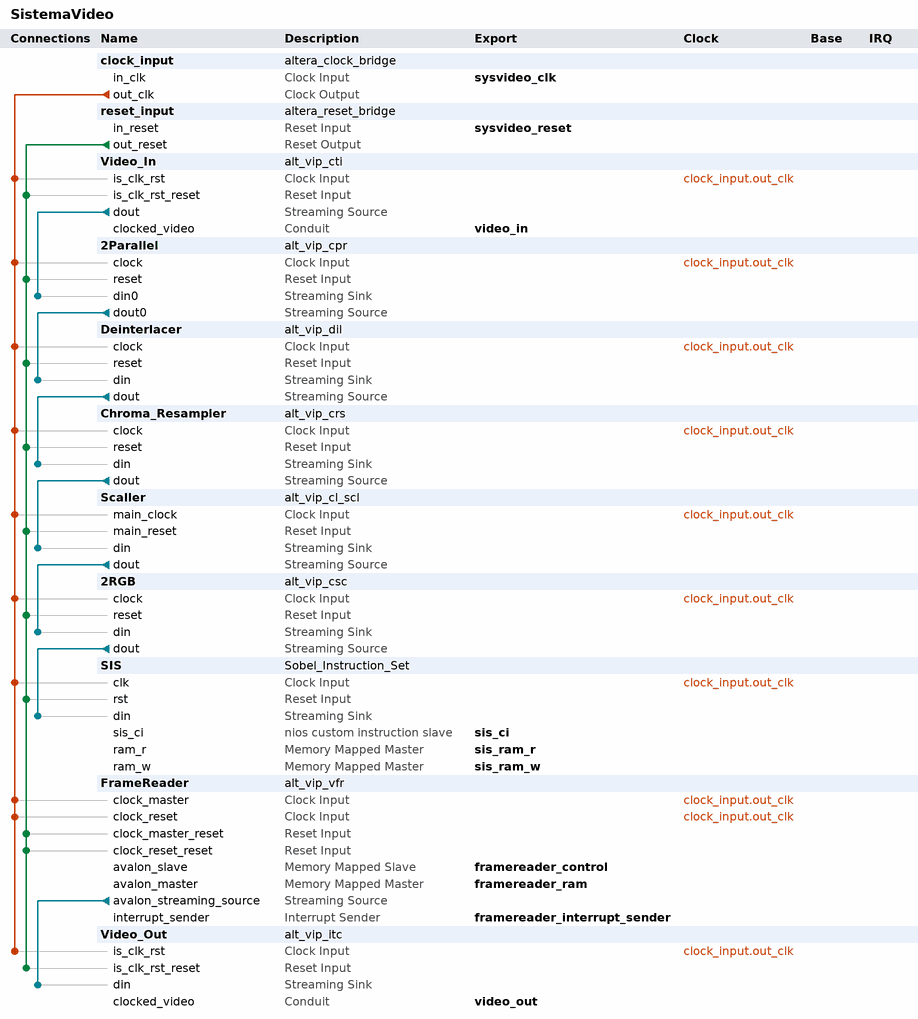
[diagram p0: system contents]
# Platform Designer (Qsys) system SistemaVideo, Cyclone III EP3C25F324C6
# Parameters at their usual value, and those the tool derives, are not listed.
package require -exact qsys 12.1
create_system SistemaVideo
set_project_property DEVICE_FAMILY {Cyclone III}
set_project_property DEVICE EP3C25F324C6

add_instance clock_input altera_clock_bridge 12.1
set_instance_parameter_value clock_input DERIVED_CLOCK_RATE 0
set_instance_parameter_value clock_input EXPLICIT_CLOCK_RATE 0

add_instance reset_input altera_reset_bridge 12.1
set_instance_parameter_value reset_input ACTIVE_LOW_RESET 0
set_instance_parameter_value reset_input SYNCHRONOUS_EDGES none

add_instance Video_In alt_vip_cti 12.1
set_instance_parameter_value Video_In FAMILY {Cyclone III}
set_instance_parameter_value Video_In BPS 8
set_instance_parameter_value Video_In NUMBER_OF_COLOUR_PLANES 2
set_instance_parameter_value Video_In COLOUR_PLANES_ARE_IN_PARALLEL 0
set_instance_parameter_value Video_In SYNC_TO 0
set_instance_parameter_value Video_In USE_EMBEDDED_SYNCS 1
set_instance_parameter_value Video_In ADD_DATA_ENABLE_SIGNAL 0
set_instance_parameter_value Video_In ACCEPT_COLOURS_IN_SEQ 0
set_instance_parameter_value Video_In USE_STD 0
set_instance_parameter_value Video_In STD_WIDTH 1
set_instance_parameter_value Video_In GENERATE_ANC 0
set_instance_parameter_value Video_In INTERLACED 1
set_instance_parameter_value Video_In H_ACTIVE_PIXELS_F0 720
set_instance_parameter_value Video_In V_ACTIVE_LINES_F0 288
set_instance_parameter_value Video_In V_ACTIVE_LINES_F1 288
set_instance_parameter_value Video_In FIFO_DEPTH 720
set_instance_parameter_value Video_In CLOCKS_ARE_SAME 0
set_instance_parameter_value Video_In USE_CONTROL 0
set_instance_parameter_value Video_In GENERATE_SYNC 0

add_instance 2Parallel alt_vip_cpr 12.1
set_instance_parameter_value 2Parallel DIN1_ENABLED 0
set_instance_parameter_value 2Parallel DOUT1_SYMBOLS_PER_BEAT 0
set_instance_parameter_value 2Parallel DOUT0_SYMBOLS_PER_BEAT 2
set_instance_parameter_value 2Parallel DOUT1_ENABLED 0
set_instance_parameter_value 2Parallel PARAMETERISATION {<colourPatternRearrangerParams><CPR_NAME>Color Plane Sequencer</CPR_NAME><CPR_BPS>8</CPR_BPS><CPR_PORTS><INPUT_PORT><NAME>din0</NAME><STREAMING_DESCRIPTOR>[C,Y]</STREAMING_DESCRIPTOR><ENABLED>true</ENABLED></INPUT_PORT><INPUT_PORT><NAME>din1</NAME><STREAMING_DESCRIPTOR>[Channel]</STREAMING_DESCRIPTOR><ENABLED>false</ENABLED></INPUT_PORT><OUTPUT_PORT><NAME>dout0</NAME><STREAMING_DESCRIPTOR>[C:Y]</STREAMING_DESCRIPTOR><ENABLED>true</ENABLED><NON_IMAGE_PACKET_SOURCE>din0</NON_IMAGE_PACKET_SOURCE><HALVE_WIDTH>false</HALVE_WIDTH></OUTPUT_PORT><OUTPUT_PORT><NAME>dout1</NAME><STREAMING_DESCRIPTOR>[Channel]</STREAMING_DESCRIPTOR><ENABLED>false</ENABLED><NON_IMAGE_PACKET_SOURCE>din0</NON_IMAGE_PACKET_SOURCE><HALVE_WIDTH>false</HALVE_WIDTH></OUTPUT_PORT></CPR_PORTS><CPR_INPUT_2_PIXELS>false</CPR_INPUT_2_PIXELS></colourPatternRearrangerParams>}
set_instance_parameter_value 2Parallel DIN0_SYMBOLS_PER_BEAT 1
set_instance_parameter_value 2Parallel DIN1_SYMBOLS_PER_BEAT 0

add_instance Deinterlacer alt_vip_dil 12.1
set_instance_parameter_value Deinterlacer READ_MASTERS_REQUIRED 0
set_instance_parameter_value Deinterlacer WRITE_MASTERS_REQUIRED 0
set_instance_parameter_value Deinterlacer PARAMETERISATION {<deinterlacerParams><DIL_NAME>my_deinterlacing_core</DIL_NAME><DIL_MAX_WIDTH>720</DIL_MAX_WIDTH><DIL_MAX_HEIGHT>576</DIL_MAX_HEIGHT><DIL_CHANNELS_IN_SEQ>1</DIL_CHANNELS_IN_SEQ><DIL_CHANNELS_IN_PAR>2</DIL_CHANNELS_IN_PAR><DIL_BPS>8</DIL_BPS><DIL_METHOD>DEINTERLACING_BOB_SCANLINE_INTERPOLATION</DIL_METHOD><DIL_FRAMEBUFFERS_ADDR>01500000</DIL_FRAMEBUFFERS_ADDR><DIL_PRODUCE_FIELDS>DEINTERLACING_BOTH</DIL_PRODUCE_FIELDS><DIL_BUFFER_AS_THOUGH>DEINTERLACING_NO_BUFFERING</DIL_BUFFER_AS_THOUGH><DIL_DEFAULT_INITIAL_FIELD>FIELD_F0_FIRST</DIL_DEFAULT_INITIAL_FIELD><DIL_MASTER_PORT_WIDTH>64</DIL_MASTER_PORT_WIDTH><DIL_MEM_MASTERS_USE_SEPARATE_CLOCK>0</DIL_MEM_MASTERS_USE_SEPARATE_CLOCK><DIL_EDGE_DEPENDENT_INTERPOLATION>1</DIL_EDGE_DEPENDENT_INTERPOLATION><DIL_MOTION_BLEED>0</DIL_MOTION_BLEED><DIL_RDATA_FIFO_DEPTH>256</DIL_RDATA_FIFO_DEPTH><DIL_RDATA_BURST_TARGET>64</DIL_RDATA_BURST_TARGET><DIL_WDATA_FIFO_DEPTH>256</DIL_WDATA_FIFO_DEPTH><DIL_WDATA_BURST_TARGET>64</DIL_WDATA_BURST_TARGET><DIL_MAX_NUMBER_PACKETS>1</DIL_MAX_NUMBER_PACKETS><DIL_MAX_SYMBOLS_IN_PACKET>10</DIL_MAX_SYMBOLS_IN_PACKET><DIL_MA_RUNTIME_CTRL>0</DIL_MA_RUNTIME_CTRL><DIL_PROPAGATE_PROGRESSIVE>false</DIL_PROPAGATE_PROGRESSIVE><DIL_CONTROLLED_DROP_REPEAT>0</DIL_CONTROLLED_DROP_REPEAT><DIL_MA_422>0</DIL_MA_422><DIL_BURST_ALIGNMENT>0</DIL_BURST_ALIGNMENT></deinterlacerParams>}
set_instance_parameter_value Deinterlacer MOTION_MASTERS_REQUIRED 0

add_instance Chroma_Resampler alt_vip_crs 12.1
set_instance_parameter_value Chroma_Resampler OUT_CHANNELS_IN_PAR 3
set_instance_parameter_value Chroma_Resampler IN_CHANNELS_IN_PAR 2
set_instance_parameter_value Chroma_Resampler PARAMETERISATION {<chromaResamplerParams><CRS_NAME>chroma_resampler</CRS_NAME><CRS_BPS>8</CRS_BPS><CRS_WIDTH>720</CRS_WIDTH><CRS_HEIGHT>576</CRS_HEIGHT><CRS_PARALLEL_MODE>true</CRS_PARALLEL_MODE><CRS_RESAMPLING><FORMAT><IN>422</IN><OUT>444</OUT></FORMAT><COSITING><V>true</V><H>true</H></COSITING></CRS_RESAMPLING><CRS_ALGORITHM><V><NAME>INTERPOLATION_1D_NEAREST_NEIGHBOUR</NAME><LUMA_ADAPTIVE>false</LUMA_ADAPTIVE></V><H><NAME>INTERPOLATION_1D_FULL_FILTERING</NAME><LUMA_ADAPTIVE>true</LUMA_ADAPTIVE></H></CRS_ALGORITHM></chromaResamplerParams>}

add_instance Scaller alt_vip_cl_scl 12.1
set_instance_parameter_value Scaller FAMILY {Cyclone III}
set_instance_parameter_value Scaller SYMBOLS_IN_SEQ 1
set_instance_parameter_value Scaller SYMBOLS_IN_PAR 3
set_instance_parameter_value Scaller BITS_PER_SYMBOL 8
set_instance_parameter_value Scaller EXTRA_PIPELINING 1
set_instance_parameter_value Scaller IS_422 0
set_instance_parameter_value Scaller NO_BLANKING 0
set_instance_parameter_value Scaller MAX_IN_WIDTH 720
set_instance_parameter_value Scaller MAX_IN_HEIGHT 576
set_instance_parameter_value Scaller MAX_OUT_WIDTH 800
set_instance_parameter_value Scaller MAX_OUT_HEIGHT 480
set_instance_parameter_value Scaller RUNTIME_CONTROL 0
set_instance_parameter_value Scaller ALWAYS_DOWNSCALE 0
set_instance_parameter_value Scaller ALGORITHM_NAME NEAREST_NEIGHBOUR
set_instance_parameter_value Scaller DEFAULT_EDGE_THRESH 7
set_instance_parameter_value Scaller DEFAULT_UPPER_BLUR 15
set_instance_parameter_value Scaller DEFAULT_LOWER_BLUR 0
set_instance_parameter_value Scaller ENABLE_FIR 0
set_instance_parameter_value Scaller ARE_IDENTICAL 0
set_instance_parameter_value Scaller V_TAPS 8
set_instance_parameter_value Scaller V_PHASES 16
set_instance_parameter_value Scaller H_TAPS 8
set_instance_parameter_value Scaller H_PHASES 16
set_instance_parameter_value Scaller V_SIGNED 1
set_instance_parameter_value Scaller V_INTEGER_BITS 1
set_instance_parameter_value Scaller V_FRACTION_BITS 7
set_instance_parameter_value Scaller H_SIGNED 1
set_instance_parameter_value Scaller H_INTEGER_BITS 1
set_instance_parameter_value Scaller H_FRACTION_BITS 7
set_instance_parameter_value Scaller PRESERVE_BITS 0
set_instance_parameter_value Scaller LOAD_AT_RUNTIME 0
set_instance_parameter_value Scaller V_BANKS 1
set_instance_parameter_value Scaller V_SYMMETRIC 0
set_instance_parameter_value Scaller V_FUNCTION LANCZOS_2
set_instance_parameter_value Scaller V_COEFF_FILE {<enter file name (including full path)>}
set_instance_parameter_value Scaller H_BANKS 1
set_instance_parameter_value Scaller H_SYMMETRIC 0
set_instance_parameter_value Scaller H_FUNCTION LANCZOS_2
set_instance_parameter_value Scaller H_COEFF_FILE {<enter file name (including full path)>}
set_instance_parameter_value Scaller IS_420 0

add_instance 2RGB alt_vip_csc 12.1
set_instance_parameter_value 2RGB PARAMETERISATION {<cscParams> <CSC_NAME>a_csc</CSC_NAME> <CSC_CHANNELS_IN_SEQ>1</CSC_CHANNELS_IN_SEQ>  <CSC_CHANNELS_IN_PAR>3</CSC_CHANNELS_IN_PAR>  <CSC_INPUT_OUTPUT_DATATYPES>   <IODT_INPUT_BPS>8</IODT_INPUT_BPS>   <IODT_OUTPUT_BPS>8</IODT_OUTPUT_BPS>   <IODT_INPUT_DATA_TYPE>DATA_TYPE_UNSIGNED</IODT_INPUT_DATA_TYPE>   <IODT_OUTPUT_DATA_TYPE>DATA_TYPE_UNSIGNED</IODT_OUTPUT_DATA_TYPE>   <IODT_USE_INPUT_GUARD_BANDS>true</IODT_USE_INPUT_GUARD_BANDS>   <IODT_INPUT_GUARD_MIN>16</IODT_INPUT_GUARD_MIN>   <IODT_INPUT_GUARD_MAX>240</IODT_INPUT_GUARD_MAX>   <IODT_USE_OUTPUT_GUARD_BANDS>false</IODT_USE_OUTPUT_GUARD_BANDS>   <IODT_OUTPUT_GUARD_MIN>0</IODT_OUTPUT_GUARD_MIN>   <IODT_OUTPUT_GUARD_MAX>255</IODT_OUTPUT_GUARD_MAX>  </CSC_INPUT_OUTPUT_DATATYPES>  <CSC_PREDEFINED_CONVERSION>SDTV_YCBCR_TO_CRGB</CSC_PREDEFINED_CONVERSION>  <CSC_COEFFICIENTS><row><mult>2.018</mult><mult>0.0</mult><mult>1.164</mult><add>-276.928</add></row><row><mult>-0.391</mult><mult>-0.813</mult><mult>1.164</mult><add>135.488</add></row><row><mult>0.0</mult><mult>1.596</mult><mult>1.164</mult><add>-222.912</add></row></CSC_COEFFICIENTS>  <CSC_COEFF_PRECISION>   <CPC_INTEGER_BITS>2</CPC_INTEGER_BITS>   <CPC_FRACTION_BITS>8</CPC_FRACTION_BITS>   <CPC_COEFFS_SIGNED>true</CPC_COEFFS_SIGNED>  </CSC_COEFF_PRECISION>  <CSC_SUMM_PRECISION>   <CPC_INTEGER_BITS>9</CPC_INTEGER_BITS>   <CPC_FRACTION_BITS>8</CPC_FRACTION_BITS>   <CPC_COEFFS_SIGNED>true</CPC_COEFFS_SIGNED>  </CSC_SUMM_PRECISION>  <CSC_OUTPUT_CONVERSION>   <ODTC_SCALE>0</ODTC_SCALE>   <ODTC_FIXEDPOINT_TO_INTEGER>FRACTION_BITS_ROUND_HALF_UP</ODTC_FIXEDPOINT_TO_INTEGER>   <ODTC_CONVERT_SIGNED_TO_UNSIGNED>CONVERT_TO_UNSIGNED_SATURATE</ODTC_CONVERT_SIGNED_TO_UNSIGNED>  </CSC_OUTPUT_CONVERSION> <CSC_RUNTIME_COEFFICIENTS>false</CSC_RUNTIME_COEFFICIENTS> </cscParams>}

add_instance SIS Sobel_Instruction_Set 1.0
set_instance_parameter_value SIS DATA_WIDTH 32
set_instance_parameter_value SIS ADD_WIDTH 32
set_instance_parameter_value SIS BURST_WIDTH_W 5
set_instance_parameter_value SIS BURST_WIDTH_R 6
set_instance_parameter_value SIS BYTE_ENABLE_WIDTH 4
set_instance_parameter_value SIS FIFO_DEPTH_LOG2 8

add_instance FrameReader alt_vip_vfr 12.1
set_instance_parameter_value FrameReader NUMBER_OF_CHANNELS_IN_PARALLEL 3
set_instance_parameter_value FrameReader MAX_IMAGE_WIDTH 800
set_instance_parameter_value FrameReader MAX_IMAGE_HEIGHT 480
set_instance_parameter_value FrameReader MEM_PORT_WIDTH 32
set_instance_parameter_value FrameReader CLOCKS_ARE_SEPARATE 0

add_instance Video_Out alt_vip_itc 12.1
set_instance_parameter_value Video_Out NUMBER_OF_COLOUR_PLANES 3
set_instance_parameter_value Video_Out H_ACTIVE_PIXELS 800
set_instance_parameter_value Video_Out V_ACTIVE_LINES 480
set_instance_parameter_value Video_Out FIFO_DEPTH 800
set_instance_parameter_value Video_Out THRESHOLD 225
set_instance_parameter_value Video_Out H_SYNC_LENGTH 1
set_instance_parameter_value Video_Out H_FRONT_PORCH 40
set_instance_parameter_value Video_Out H_BACK_PORCH 216
set_instance_parameter_value Video_Out V_SYNC_LENGTH 1
set_instance_parameter_value Video_Out V_FRONT_PORCH 10
set_instance_parameter_value Video_Out V_BACK_PORCH 35

# connections
add_connection clock_input.out_clk 2Parallel.clock clock
add_connection clock_input.out_clk 2RGB.clock clock
add_connection clock_input.out_clk Chroma_Resampler.clock clock
add_connection clock_input.out_clk Deinterlacer.clock clock
add_connection clock_input.out_clk FrameReader.clock_master clock
add_connection clock_input.out_clk FrameReader.clock_reset clock
add_connection clock_input.out_clk Scaller.main_clock clock
add_connection clock_input.out_clk SIS.clk clock
add_connection clock_input.out_clk Video_In.is_clk_rst clock
add_connection clock_input.out_clk Video_Out.is_clk_rst clock
add_connection reset_input.out_reset 2Parallel.reset reset
add_connection reset_input.out_reset 2RGB.reset reset
add_connection reset_input.out_reset Chroma_Resampler.reset reset
add_connection reset_input.out_reset Deinterlacer.reset reset
add_connection reset_input.out_reset FrameReader.clock_master_reset reset
add_connection reset_input.out_reset FrameReader.clock_reset_reset reset
add_connection reset_input.out_reset Scaller.main_reset reset
add_connection reset_input.out_reset SIS.rst reset
add_connection reset_input.out_reset Video_In.is_clk_rst_reset reset
add_connection reset_input.out_reset Video_Out.is_clk_rst_reset reset
add_connection 2Parallel.dout0 Deinterlacer.din avalon_streaming
add_connection 2RGB.dout SIS.din avalon_streaming
add_connection Chroma_Resampler.dout Scaller.din avalon_streaming
add_connection Deinterlacer.dout Chroma_Resampler.din avalon_streaming
add_connection FrameReader.avalon_streaming_source Video_Out.din avalon_streaming
add_connection Scaller.dout 2RGB.din avalon_streaming
add_connection Video_In.dout 2Parallel.din0 avalon_streaming

# exported interfaces
add_interface video_out conduit end
set_interface_property video_out EXPORT_OF Video_Out.clocked_video
add_interface sysvideo_reset reset sink
set_interface_property sysvideo_reset EXPORT_OF reset_input.in_reset
add_interface video_in conduit end
set_interface_property video_in EXPORT_OF Video_In.clocked_video
add_interface sysvideo_clk clock sink
set_interface_property sysvideo_clk EXPORT_OF clock_input.in_clk
add_interface framereader_control avalon slave
set_interface_property framereader_control EXPORT_OF FrameReader.avalon_slave
add_interface framereader_ram avalon master
set_interface_property framereader_ram EXPORT_OF FrameReader.avalon_master
add_interface framereader_interrupt_sender interrupt sender
set_interface_property framereader_interrupt_sender EXPORT_OF FrameReader.interrupt_sender
add_interface sis_ram_w avalon master
set_interface_property sis_ram_w EXPORT_OF SIS.ram_w
add_interface sis_ram_r avalon master
set_interface_property sis_ram_r EXPORT_OF SIS.ram_r
add_interface sis_ci nios_custom_instruction end
set_interface_property sis_ci EXPORT_OF SIS.sis_ci

save_system SistemaVideo.qsys
